# EasyEDA Pro project sfy3-v3.1.4.epro, board PCB_sfy3_1_1
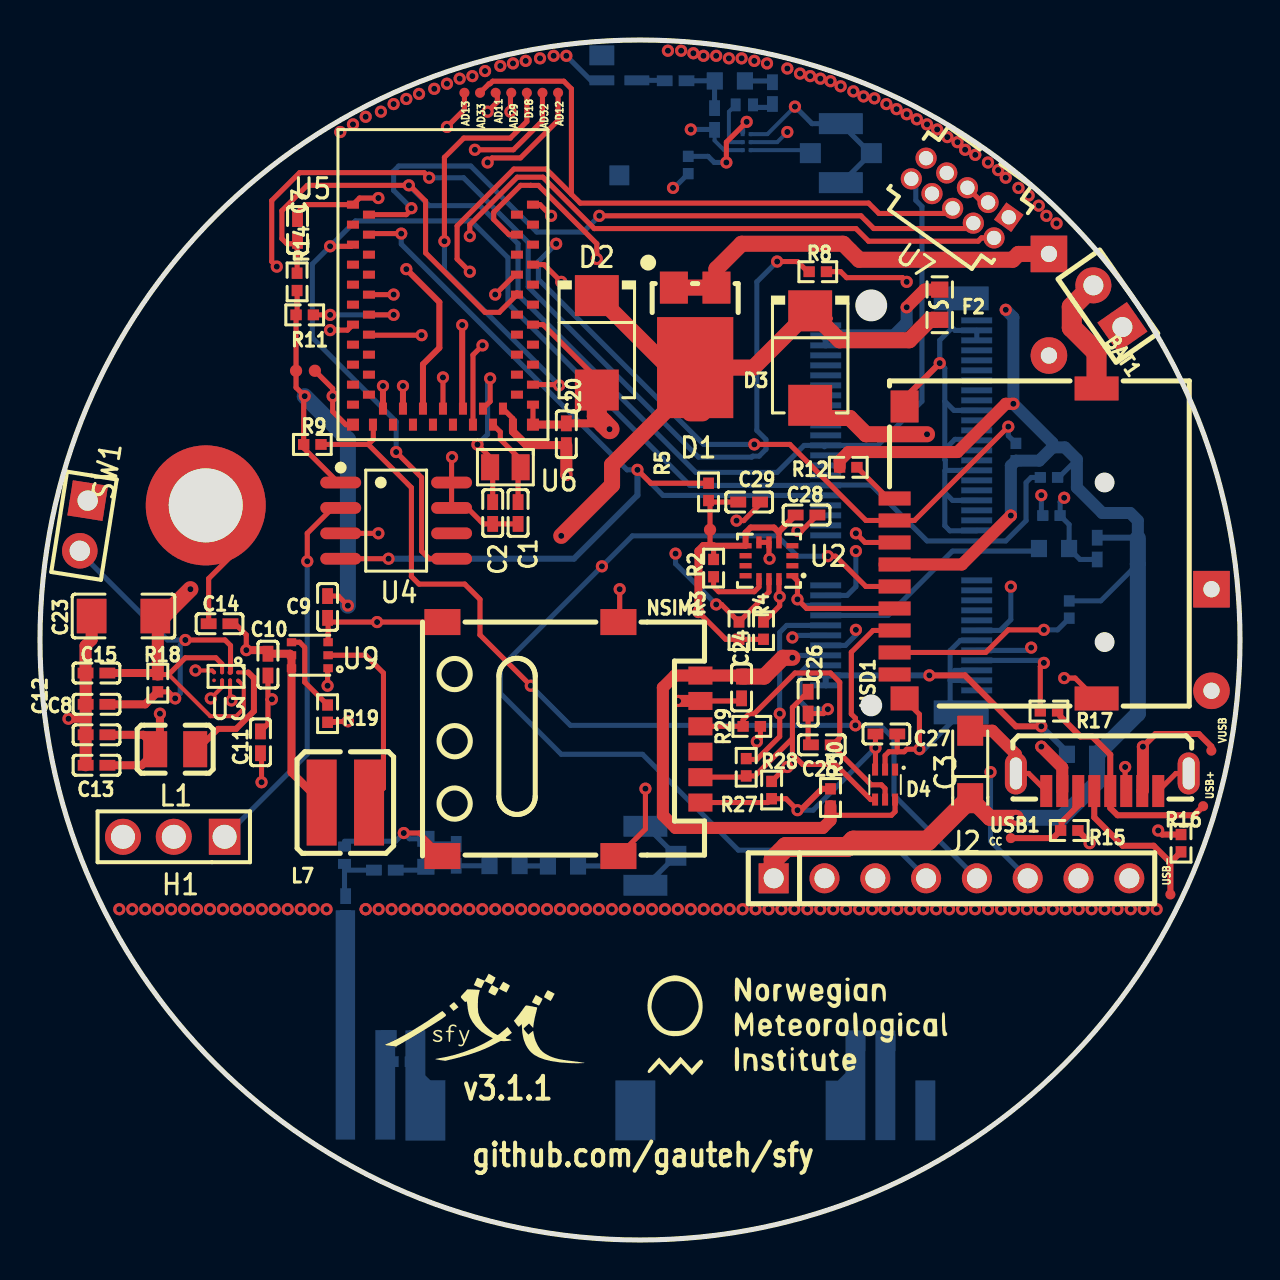
[diagram p32: board, top side]
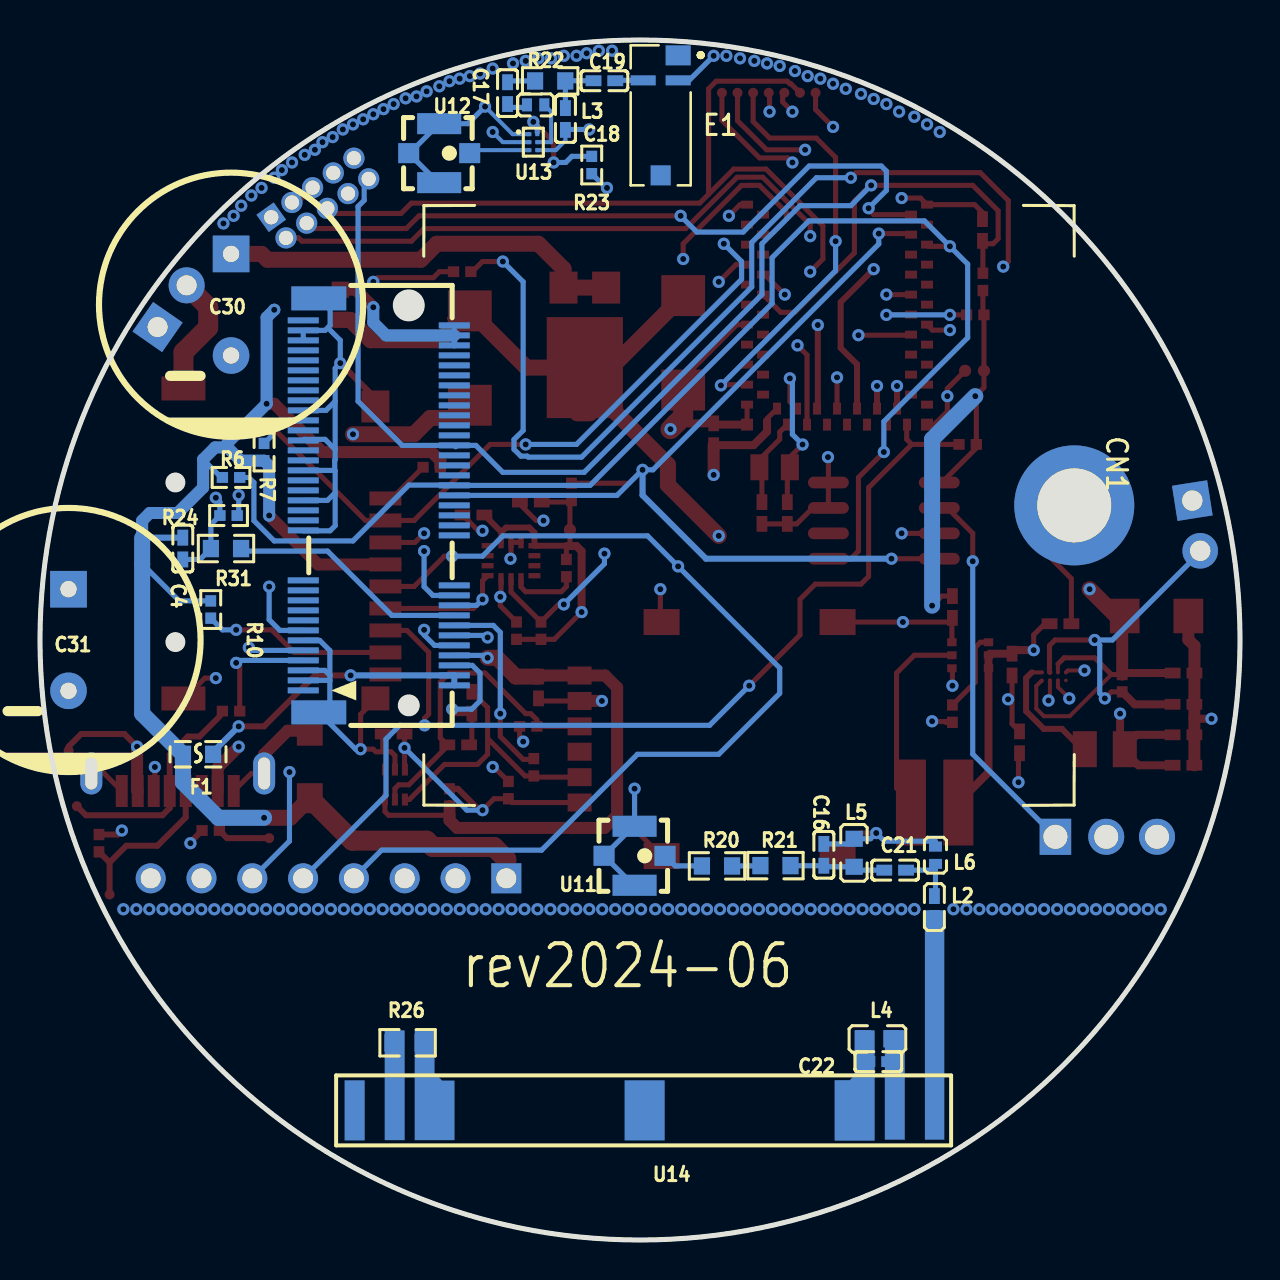
[diagram p33: board, bottom side, seen from below]

Outline 60 x 60 mm; copper layers: Top Layer, GND, POWER, Bottom Layer. Coordinates in mm from the lower left corner of the outline.
Outline path: circle c30,30 r30
Stack: Top Layer 0.035mm 外层铜厚1oz / Dielectric1 0.2104mm 7628 RC49% 8.6mil / GND 0.0152mm 内层铜厚 / Dielectric2 1.065mm 1.1mm H/HOZ 含铜 / POWER 0.0152mm 内层铜厚 / Dielectric3 0.2104mm 7628 RC49% 8.6mil / Bottom Layer 0.035mm 外层铜厚1oz

## Design rules (mm)
template: User Custom Config
spacing Default (default): track to track 0.152, other pairs 0 to 0.152
track width Default (default): min 0.2, default 0.254, max 25.4
differential pair differentialPair (default): width min 0.127, default 0.254, max 2.54; gap min 0.152, default 0.152
via Default (default): diameter min 0.61, default 0.61, max 100.025; hole min 0.305, default 0.305, max 59.995

## Placement (name value [footprint] x y rotation side)
AD11  -  [Test-Point-0.5mm]  22.78 57.36 0 top
AD12  -  [Test-Point-0.5mm]  25.9 57.36 0 top
AD13  -  [Test-Point-0.5mm]  21.22 57.36 0 top
AD29  -  [Test-Point-0.5mm]  23.56 57.36 0 top
AD32  -  [Test-Point-0.5mm]  25.12 57.36 0 top
AD33  -  [Test-Point-0.5mm]  22 57.36 0 top
BAT1  22284020  [HDR-TH_2P-P2.54-V-M-1]  53.39 46.69 124.8 top
C1  15pF  [C0402]  23.9 36.35 270 top
C2  15pF  [C0402]  22.63 36.35 270 top
C3  10uF  [CAP-SMD_L3.2-W1.6-RD]  46.51 23.78 90 top
C4  100nF  [C0402]  52.86 34.57 90 bottom
C7  1nF  [C0402]  12.88 50.5 90 top
C8  100nF  [C0402]  2.83 26.78 180 top
C9  100nF  [C0402]  14.38 31.65 270 top
C10  100nF  [C0402]  11.4 28.77 270 top
C11  10uF  [C0402]  11.02 24.88 90 top
C12  10uF  [C0402]  2.83 25.26 180 top
C13  10uF  [C0402]  2.83 23.74 180 top
C14  10uF  [C0402]  8.98 30.81 180 top
C15  4.7uF  [C0402]  2.82 28.35 0 top
C16  1pF  [C0402]  20.81 19.26 270 bottom
C17  1nF  [C0402]  36.62 57.34 90 bottom
C18  4.6pF  [C0402]  33.73 56.05 90 bottom
C19  1.1pF  [C0402]  31.78 57.96 180 bottom
C20  1uF  [C0402]  26.32 40.29 270 top
C21  2.2pF  [C0402]  17.24 18.49 180 bottom
C22  0.5pF  [C0402]  18.09 8.92 0 bottom
C23  47uF  [C1206]  4.17 31.2 0 top
C24  100nF  [C0402]  35.08 27.63 270 top
C25  33pF  [C0402]  39.09 24.76 0 top
C26  33pF  [C0402]  38.41 26.87 90 top
C27  33pF  [C0402]  42.32 25.3 180 top
C28  100nF  [C0402]  38.33 36.25 0 top
C29  100nF  [C0402]  35.46 36.9 0 top
C30  10F  [CP_12.5X20MM]  50.45 46.76 0 bottom
C31  10F  [CP_12.5X20MM]  58.58 30 0 bottom
CC  -  [Test-Point-0.5mm]  48.54 20.09 0 top
CN1  NOTECARD CONNECTOR  [NOTECARD-ext]  9.81 36.73 270 bottom
D1  FSV1045V  [TO-277A_L6.1-W4.6-P2.13-LS6.5-TR]  32.76 45.62 90 top
D2  SM6T6V8A  [SMB_L4.6-W3.6-LS5.3-RD]  27.84 44.86 270 top
D3  STPS3H100U  [SMB_L4.6-W3.6-LS5.3-RD]  38.51 44.1 270 top
D4  CESDLC5V0M5  [SOT-563_L1.6-W1.2-P0.50-LS1.6-BR]  42.25 22.77 90 top
D18  -  [Test-Point-0.5mm]  24.34 57.36 0 top
E1  -  [NN03-320]  28.97 56.23 90 bottom
F1  046701.5NRHF  [F0603]  52.1 24.28 0 bottom
F2  F0603FA3500V032T  [F0603]  44.99 46.76 270 top
H1  Header-Male-2.54_1x3  [HDR-TH_3P-P2.54-V-M-1]  6.69 20.16 180 top
J2  Header2.54mm 1*8P  [HDR-TH_8P-P2.54-V-M]  45.58 18.09 0 top
L1  2.2uH  [L0806]  6.76 24.54 0 top
L2  2.3nH  [L0402]  15.28 16.65 270 bottom
L3  7.5nH  [IND-SMD_L1.0-W0.6]  35.22 56.76 0 bottom
L4  12nH  [L0603]  18.14 10.06 0 bottom
L5  10nH  [L0603]  19.29 19.36 90 bottom
L6  8.4nH  [IND-SMD_L1.0-W0.6]  15.23 19.24 90 bottom
L7  2.2uH  [IND-SMD_L4.0-W4.0_XAL4040-103]  15.27 21.87 180 top
NOREF  -  [Pad_e50]  33.5 35.51 0 top
NOREF#2  -  [Pad_e1168]  13.74 43.46 0 top
NOREF#3  -  [Pad_e1148]  12.8 43.46 0 top
NSIM1  SMN-305  [SIM-SMD_SMN-305]  26.57 25.05 270 top
R2  10kΩ  [R0402]  33.68 33.59 90 top
R3  10kΩ  [R0402]  34.95 30.47 270 top
R4  10kΩ  [R0402]  36.18 30.47 270 top
R5  10kΩ  [R0402]  33.43 37.41 270 top
R6  10kΩ  [R0402]  50.45 38.13 0 bottom
R7  10kΩ  [R0402]  48.8 39.4 270 bottom
R8  10kΩ  [R0402]  38.89 48.42 0 top
R9  10kΩ  [R0402]  13.62 39.78 180 top
R10  10kΩ  [R0402]  51.46 31.52 90 bottom
R11  10kΩ  [R0402]  13.24 46.26 180 top
R12  10kΩ  [R0402]  40.41 38.64 180 top
R14  100kΩ  [R0402]  12.86 47.91 270 top
R15  5.1kΩ  [R0402]  51.46 20.48 0 top
R16  22Ω  [R0402]  57.05 19.84 90 top
R17  22Ω  [R0402]  50.45 26.44 180 top
R18  10MΩ  [R0402]  5.89 27.84 90 top
R19  82kΩ  [R0402]  14.38 26.32 90 top
R20  0Ω  [R0603]  26.15 18.7 180 bottom
R21  0Ω  [R0603]  23.23 18.72 180 bottom
R22  0Ω  [R0603]  34.49 57.95 180 bottom
R23  200kΩ  [R0402]  32.41 53.75 270 bottom
R24  100kΩ  [R0402]  50.57 36.22 180 bottom
R26  0Ω  [R0603]  41.62 9.86 0 bottom
R27  22Ω  [R0402]  36.58 22.5 270 top
R28  22Ω  [R0402]  35.31 23.64 270 top
R29  22Ω  [R0402]  35.59 25.68 180 top
R30  15kΩ  [R0402]  39.53 22.13 270 top
R31  0Ω  [R0603]  50.7 34.57 0 bottom
SW1  M.sw.  [2P]  2.19 35.72 261.1 top
U2  ISM330DHCXTR  [LGA-14_L3.0-W2.5-P0.50-BR]  36.45 33.96 0 top
U3  TPS62748YFPT  [DSBGA-8_L1.6-W0.9-R2-C4-P0.40-BL]  9.3 28.18 180 top
U4  DS2482S-100+T&R  [SOIC-8_L4.9-W3.9-P1.27-LS6.0-BL]  17.81 35.97 270 top
U5  SPARKFUN ARTEMIS BLE MODULE  [ARTEMIS_BLE]  15.65 40.77 90 top
U6  32.768kHz  [CRYSTAL-SMD_L2.0-W1.2]  23.27 38.64 180 top
U7  FTSH-105-01-F-D-K  [CONN-TH_10P-P1.27_FTSH-105-01-F-D-K]  46 52.1 144.5 top
U9  MAX17225ELT+T  [UDFN-6_L2.0-W2.0-P0.65-BL]  13.49 29.24 90 top
U11  CONMHF1-SMD-G-T  [RF-SMD_CONMHF1-SMD-G-T]  30.27 19.21 270 bottom
U12  CONMHF1-SMD-G-T  [RF-SMD_CONMHF1-SMD-G-T]  40.04 54.34 270 bottom
U13  BGA725L6E6327FTSA1  [TSLP-6_L1.1-W0.7-P0.40-BR]  35.33 54.89 0 bottom
U14  -  [NN03-310-NoSilk]  15.27 6.5 0 bottom
USB1  YTC-TC8S-125  [USB-C-SMD_YIYUAN_YTC-TC8S-125]  53.11 22.89 0 top
USB+  -  [Test-Point-0.5mm]  58.16 21.69 0 top
USB-  -  [Test-Point-0.5mm]  56.52 17.28 0 top
USD1  TF-CARD H1.8  [TF-SMD_TF-CARD-H1.8]  47.78 34.83 90 top
VUSB  -  [Test-Point-0.5mm]  58.57 24.47 0 top

## Footprints (pads in the part's own frame, mm; a bottom-side part is the same pattern mirrored in y, then rotated)
2P
  rect 1.778x1.778 hole 1.016: 1(-1.27,0)
  round 1.778 hole 1.016: 2(1.27,0)
ARTEMIS_BLE
  rect 0.4x0.6 smd: 1(11,0) 2(10.5,-0.8) 3(10,0) 4(9.5,-0.8) 5(9,0) 6(8.5,-0.8) 7(8,0) 8(7.5,-0.8) 9(7,0) 10(6.5,-0.8) 11(6,0) 12(5.5,-0.8) 13(5,0) 14(4.5,-0.8) 15(4,0) 16(3.5,-0.8) 17(3,0) 18(2.5,-0.8) 19(2,0) 20(1.5,-0.8) 21(1,0) 39(1,-8.999) 40(1.5,-8.2) 41(2,-8.999) 42(2.5,-8.2) 43(3,-8.999) 44(3.5,-8.2) 45(4,-8.999) 46(4.5,-8.2) 47(5,-8.999) 48(5.5,-8.2) 49(6,-8.999) 50(6.5,-8.2) 51(7,-8.999) 52(7.5,-8.2) 53(8,-8.999) 54(8.5,-8.2) 55(9,-8.999) 56(9.5,-8.2) 57(10,-8.999) 58(10.5,-8.2) 59(11,-8.999)
  rect 0.6x0.6 smd: 22(0,0) 38(0,-8.999)
  rect 0.6x0.4 smd: 23(0,-1) 24(0.8,-1.5) 25(0,-2) 26(0.8,-2.5) 27(0,-2.999) 28(0.8,-3.5) 29(0,-3.999) 30(0.8,-4.5) 31(0,-5) 32(0.8,-5.5) 33(0,-6) 34(0.8,-6.5) 35(0,-7) 36(0.8,-7.5) 37(0,-8)
C0402
  rect 0.79x0.54 smd: 1(-0.545,0) 2(0.545,0)
C1206
  rect 1.485x1.728 smd: 1(-1.593,0) 2(1.593,0)
CAP-SMD_L3.2-W1.6-RD
  rect 1.5x1.296 smd: 1(-1.687,0) 2(1.687,0)
CONN-TH_10P-P1.27_FTSH-105-01-F-D-K
  rect 1.06x1.06 hole 0.715x0.71: 1(-2.54,-0.635)
  round 1.06 hole 0.715x0.71: 2(-2.54,0.635) 3(-1.27,-0.635) 4(-1.27,0.635) 5(0,-0.635) 6(0,0.635) 7(1.27,-0.635) 8(1.27,0.635) 9(2.54,-0.635) 10(2.54,0.635)
CP_12.5X20MM
  rect 1.829x1.829 hole 0.813: 1(0,-2.54)
  round 1.829 hole 0.813: 2(0,2.54)
CRYSTAL-SMD_L2.0-W1.2
  rect 0.9x1.3 smd: 1(-0.762,0) 2(0.762,0)
DSBGA-8_L1.6-W0.9-R2-C4-P0.40-BL
  round 0.184 smd: A1(-0.6,-0.2) A2(-0.6,0.2) B1(-0.2,-0.2) B2(-0.2,0.2) C1(0.2,-0.2) C2(0.2,0.2) D1(0.6,-0.2) D2(0.6,0.2)
F0603
  rect 0.806x0.864 smd: 1(-0.753,0) 2(0.753,0)
HDR-TH_2P-P2.54-V-M-1
  rect 1.8x1.8 hole 1: 1(-1.27,0)
  round 1.8 hole 1: 2(1.27,0)
HDR-TH_3P-P2.54-V-M-1
  rect 1.575x1.8 hole 1.2: 1(-2.54,0)
  round 1.8 hole 1.2: 2(0,0) 3(2.54,0)
HDR-TH_8P-P2.54-V-M
  rect 1.5x1.5 hole 1: 1(-8.89,0)
  round 1.5 hole 1: 2(-6.35,0) 3(-3.81,0) 4(-1.27,0) 5(1.27,0) 6(3.81,0) 7(6.35,0) 8(8.89,0)
IND-SMD_L1.0-W0.6
  rect 0.5x0.648 smd: 1(-0.434,0) 2(0.434,0)
IND-SMD_L4.0-W4.0_XAL4040-103
  rect 1.5x4.3 smd: 1(-1.185,0) 2(1.185,0)
L0402
  rect 0.79x0.54 smd: 1(-0.545,0) 2(0.545,0)
L0603
  rect 0.8x0.864 smd: 1(-0.7,0) 2(0.7,0)
L0806
  rect 1.2x1.8 smd: 1(-1,0) 2(1,0)
LGA-14_L3.0-W2.5-P0.50-BR
  rect 0.6x0.27 smd: 1(1.17,-0.75) 2(1.17,-0.25) 3(1.17,0.25) 4(1.17,0.75) 8(-1.17,0.75) 9(-1.17,0.25) 10(-1.17,-0.25) 11(-1.17,-0.75)
  rect 0.27x0.6 smd: 5(0.5,0.92) 6(0,0.92) 7(-0.5,0.92) 12(-0.5,-0.92) 13(0,-0.92) 14(0.5,-0.92)
NN03-310-NoSilk
  custom 0.97x11.48 smd: 1(0.003,-4.242)
  custom 0.992x5.499 smd: 2(1.994,-1.238)
  custom 2.001x5.513 smd: 3(4,-1.22)
  rect 2x3 smd: 4(14.5,0.025)
  custom 1.986x5.486 smd: 5(25.003,-1.232)
  custom 0.992x5.486 smd: 6(27,-1.232)
  rect 1x3 smd: 7(29,0.025)
NN03-320
  rect 1x1 smd: 1(-3,0)
  custom 0.5x1.25 smd: 2(1.75,-0.875) 4(1.75,0.875)
  custom 1x1.25 smd: 3(3,-0.875)
NOTECARD-ext
  round 6 hole 3.7: 0(0,1.524)
  rect 0.3x1.55 smd: 1(9.25,-37.025) 2(9,-29.475) 3(8.751,-37.025) 4(8.5,-29.475) 5(8.25,-37.025) 6(8,-29.475) 7(7.75,-37.025) 8(7.5,-29.475) 9(7.25,-37.025) 10(7,-29.475) 11(6.75,-37.025) 12(6.5,-29.475) 13(6.25,-37.025) 14(6,-29.475) 15(5.75,-37.025) 16(5.5,-29.475) 17(5.25,-37.025) 18(5,-29.475) 19(4.75,-37.025) 20(4.5,-29.475) 21(4.25,-37.025) 22(4,-29.475) 23(3.751,-37.025) 32(1.5,-29.475) 33(1.25,-37.025) 34(1,-29.475) 35(0.75,-37.025) 36(0.5,-29.475) 37(0.25,-37.025) 38(0.001,-29.475) 39(-0.249,-37.025) 40(-0.5,-29.475) 41(-0.75,-37.025) 42(-1,-29.475) 43(-1.25,-37.025) 44(-1.5,-29.475) 45(-1.75,-37.025) 46(-2,-29.475) 47(-2.249,-37.025) 48(-2.5,-29.475) 49(-2.75,-37.025) 50(-2.999,-29.475) 51(-3.249,-37.025) 52(-3.5,-29.475) 53(-3.75,-37.025) 54(-3.999,-29.475) 55(-4.25,-37.025) 56(-4.5,-29.475) 57(-4.75,-37.025) 58(-5,-29.475) 59(-5.25,-37.025) 60(-5.5,-29.475) 61(-5.75,-37.025) 62(-6,-29.475) 63(-6.25,-37.025) 64(-6.5,-29.475) 65(-6.75,-37.025) 66(-7,-29.475) 67(-7.25,-37.025) 68(-7.5,-29.475) 69(-7.75,-37.025) 70(-8,-29.475) 71(-8.249,-37.025) 72(-8.5,-29.475) 73(-8.75,-37.025) 74(-8.999,-29.475) 75(-9.249,-37.025)
  rect 1.2x2.75 smd: 76(-10.35,-36.25) 77(10.35,-36.25)
Pad_e50
  round 0.61 smd: TP1(0,0)
Pad_e1148
  round 0.61 smd: TP1(0,0)
Pad_e1168
  round 0.61 smd: TP3(0,0)
R0402
  rect 0.566x0.54 smd: 1(-0.433,0) 2(0.433,0)
R0603
  rect 0.806x0.864 smd: 1(-0.753,0) 2(0.753,0)
RF-SMD_CONMHF1-SMD-G-T
  rect 1x1.05 smd: 1(0,1.525) 4(0,-1.525)
  rect 1.05x2.2 smd: 2(-1.475,0) 3(1.475,0)
SIM-SMD_SMN-305
  rect 1.3x1.8 smd: 1(5.85,-6.45) 2(-5.85,-6.45) 3(5.85,2.35) 4(-5.85,2.35)
  rect 0.9x1.2 smd: C1(-3.175,6.45) C2(-0.635,6.45) C3(1.905,6.45) C5(-1.905,6.45) C6(0.635,6.45) C7(3.175,6.45)
SMB_L4.6-W3.6-LS5.3-RD
  rect 2.047x2.192 smd: 1(-2.361,0) 2(2.361,0)
SOIC-8_L4.9-W3.9-P1.27-LS6.0-BL
  oval 0.588x2.045 smd: 1(-1.905,-2.772) 2(-0.635,-2.772) 3(0.635,-2.772) 4(1.905,-2.772) 5(1.905,2.772) 6(0.635,2.772) 7(-0.635,2.772) 8(-1.905,2.772)
SOT-563_L1.6-W1.2-P0.50-LS1.6-BR
  rect 0.6x0.3 smd: 1(0.75,-0.5) 2(0.75,0) 3(0.75,0.5) 4(-0.75,0.5) 5(-0.75,0) 6(-0.75,-0.5)
Test-Point-0.5mm
  round 0.5 smd: 1(0,0)
TF-SMD_TF-CARD-H1.8
  rect 0.7x1.6 smd: 1(2.25,5.05) 2(1.15,5.05) 3(0.05,5.05) 4(-1.05,5.05) 5(-2.15,5.05) 6(-3.25,5.05) 7(-4.35,5.05) 8(-5.45,5.05) 9(-6.55,5.05)
  rect 1.2x1.4 smd: 10(-7.747,4.55)
  rect 1.2x2.2 smd: 11(-7.75,-5.05) 12(7.75,-5.05)
  rect 1.6x1.4 smd: 13(6.85,4.55)
TO-277A_L6.1-W4.6-P2.13-LS6.5-TR
  rect 1.6x1.4 smd: 1(2,1.065) 2(2,-1.065)
  rect 5.05x3.81 smd: 3(-2,0)
TSLP-6_L1.1-W0.7-P0.40-BR
  rect 0.2x0.2 smd: 1(0.2,-0.4) 2(0.2,0) 3(0.2,0.4) 4(-0.2,0.4) 5(-0.2,0) 6(-0.2,-0.4)
UDFN-6_L2.0-W2.0-P0.65-BL
  rect 0.4x0.47 smd: 1(-0.65,-0.915) 2(0,-0.915) 3(0.65,-0.915) 4(0.65,0.915) 5(0,0.915) 6(-0.65,0.915)
USB-C-SMD_YIYUAN_YTC-TC8S-125
  oval 1.1x2.1 hole 0.6x1.6: 10(4.32,0.44) 11(-4.32,0.44)
  rect 0.6x1.6 smd: A5(-1.2,-0.44) A8(1.2,-0.44) A9(2,-0.44) A12(2.8,-0.44) B6(0.4,-0.44) B7(-0.4,-0.44) B9(-2,-0.44) B12(-2.8,-0.44)

## Nets
As in the schematic, except:
+3V3: C3.1 C4.2 C9.1 C11.1 C20.2 C28.1 C29.1 F1.2 H1.2 J2.1 NOREF.TP1 NOREF#3.TP1 R2.2 R3.2 R4.2 R5.2 R6.2 R7.2 R8.2 R9.2 R10.2 R11.2 R12.2 R14.2 U2.5 U2.8 U4.1 U5.36 U5.37 U7.1 U9.1 U13.2 USD1.4
GND: BAT1.2 C1.2 C2.2 C3.2 C4.1 C7.2 C8.2 C9.2 C10.2 C11.2 C12.2 C13.2 C14.2 C15.1 C16.1 C18.1 C20.1 C23.1 C24.2 C25.1 C26.1 C27.1 C28.2 C29.2 C31.2 CN1.0 CN1.3 CN1.5 CN1.6 CN1.11 CN1.18 CN1.33 CN1.39 CN1.45 CN1.51 CN1.57 CN1.71 CN1.73 CN1.76 CN1.77 D2.2 D4.2 E1.2 H1.3 J2.2 L5.2 L6.2 NOREF#2.TP3 NSIM1.1 NSIM1.2 NSIM1.3 NSIM1.4 NSIM1.C5 R15.2 R19.1 R24.1 R31.2 SW1.1 U2.1 U2.6 U2.7 U3.B2 U3.D1 U4.3 U4.7 U4.8 U5.1 U5.22 U5.38 U5.39 U5.47 U5.59 U7.3 U7.5 U7.9 U9.3 U11.2 U11.3 U11.4 U12.2 U12.3 U12.4 U13.1 U13.4 USB1.10 USB1.11 USB1.A8 USB1.A12 USB1.B12 USD1.6 USD1.10 USD1.11 USD1.12 USD1.13

Pads without a net: CN1 1 15 17 19 21 22 23 32 34 35 36 37 38 41 43 44 46 47 48 49 52 53 54 55 56 58 59 60 61 62 63 64 65 66 67 68 69 75; D4 1; E1 1 3; J2 3 8; NSIM1 C6; U2 2 3 4 9 10 11; U3 D2; U4 6; U5 3 6 7 8 9 11 15 16 17 18 19 20 21 25 27 29 31 40 42 43 44 45 46 48 49 51 54 55 57 58; U7 7 8; U14 4 7; USD1 9

## Via types
v1: diameter 0.61, hole 0.305, Top Layer to Bottom Layer, 255 vias

## Routing (per net, layer and track width the routed paths; a pad name or vN(x,y) marks a point on that pad's centre or on a via; arc(x,y) is an arc through that point)
1V8: length 27.2
  Top Layer w0.2: v1(8.54,27.08) 9.1,27.65 9.1,27.98
  Top Layer w0.254: v1(10.32,29.49) 10.32,30.25 9.76,30.81 C14.1
  Top Layer w0.4: 3.37,25.26 5.17,25.26 5.89,24.54 ; v1(6,26.32) 6,24.65 5.89,24.54 ; 5.89,24.54 5.08,23.74 3.37,23.74 ; L7.2 12.58,23.38 U9.6 U9.5 12.5,29.31 C10.1 11.22,29.49 v1(10.32,29.49)
  POWER w0.4: v1(10.32,29.49) 9.55,29.49 8.54,28.48 v1(8.54,27.08) 7.78,26.32 v1(6,26.32)
+3V3: length 215.8
  Top Layer w0.254: v1(15.4,31.72) 14.92,32.2 C9.1 ; v1(11.08,22.89) 11.08,24.29 C11.1 ; 12.86,46.31 R14.2 ; 12.86,46.31 12.86,46.26 ; 12.86,46.31 R11.2 NOREF#3.TP1 12.8,42.62 v1(13.24,42.19) 13.18,42.14 13.18,39.6 14.91,37.87 U4.1 ; U5.36 23.65,41.07 U5.37 ; R5.2 33.5,36.9 ; 33.5,36.9 C29.1 ; 33.5,36.9 NOREF.TP1 33.5,34.84 33.68,34.66 R2.2 ; R8.2 40.03,48.42 40.33,48.12 43.12,48.12 v1(43.34,47.91) ; U9.1 14.38,28.56 v1(14.38,27.71) ; R4.2 R3.2 34.28,30.03 v1(32.92,31.4) ; 36.95,35.37 U2.5
  Top Layer w0.3: C28.1 36.95,35.42 36.95,35.37 36.7,35.62 35.53,35.62 35.28,35.37 U2.8 33.73,34.71 33.68,34.66
  Top Layer w0.4: 33.64,34.7 33.18,34.7 32.92,34.45 v1(32.92,31.4) ; C20.2 24.32,39.74 23.65,40.42 U5.37
  Top Layer w0.6: v1(26.32,38.26) C20.2 ; v1(48.67,41.81) 48.29,41.81 45.88,39.4 40.42,39.4 39.98,38.96 R12.2 ; 42.23,33.78 46.09,33.78 v1(48.54,36.22)
  Top Layer w0.8: v1(48.8,21.11) 47.49,21.11 C3.1
  Top Layer w1: C3.1 44.39,19.97 40.67,19.97 40.35,19.65 37.3,19.65 36.69,19.03 J2.1
  POWER w0.254: v1(32.92,31.4) 32.79,31.4 ; 48.44,51.27 49.05,50.65 49.05,49.65 48.29,48.89 v1(48.29,46.51)
  POWER w0.6: v1(37.37,55.4) 37.37,53.88 v1(43.34,47.91) 44.73,46.51 v1(48.29,46.51)
  POWER w0.8: v1(26.32,38.26) 26.32,37.37 31.78,31.91 32.41,31.91 v1(32.92,31.4) ; H1.2 6.69,21.8 7.39,22.51 10.7,22.51 v1(11.08,22.89)
  POWER w1: 31.78,31.91 30.89,31.02 25.17,31.02 24.28,31.91 15.58,31.91 v1(15.4,31.72) 15.4,28.22 14.89,27.71 v1(14.38,27.71) 13.74,27.71 11.08,25.05 v1(11.08,22.89) ; J2.1 36.66,18.06 34.45,18.06 32.92,19.59 v1(32.92,31.4)
  Bottom Layer w0.2: v1(37.37,55.4) 36.86,54.89 U13.2
  Bottom Layer w0.254: R10.2 53.04,31.96 54.89,33.81 ; R6.2 50.94,38.13 51.84,39.03
  Bottom Layer w0.3: C4.2 54.87,35.12 54.89,35.09
  Bottom Layer w0.6: v1(48.29,46.51) 48.67,46.13 v1(48.67,41.81) 50.63,39.85 50.63,39.63 ; 50.63,39.63 49.96,38.97 R7.2 48.54,38.71 v1(48.54,36.22) ; 50.63,39.63 51.24,39.63 51.84,39.03 51.84,37.62 53.11,36.35 54.51,36.35 54.89,35.97 54.89,35.09
  Bottom Layer w0.8: 54.89,35.09 54.89,26.32 52.86,24.28 F1.2 52.85,22.88 51.08,21.11 v1(48.8,21.11) ; v1(13.24,42.19) 15.4,40.03 v1(15.4,31.72)
GND: length 180.7
  Top Layer w0.2: 9.5,27.98 9.5,27.05 v1(9.57,26.98) ; v1(7.78,28.48) 8.61,28.48 8.7,28.38
  Top Layer w0.254: 14.41,31.08 14.59,30.9 v1(16.86,30.9) NSIM1.2 ; 14.41,31.08 C9.2 ; 14.41,31.08 U9.3 ; 42.86,24.41 42.45,24.41 42.25,24.22 D4.2 ; 42.86,24.41 43.21,24.41 43.34,24.54 v1(43.97,24.54) 43.97,26.28 43.23,27.03 ; 42.86,24.41 C27.1 ; v1(28.98,32.54) 28.98,30.96 NSIM1.4 ; NSIM1.3 30.27,20.55 v1(30.27,22.57) ; R19.1 14.71,25.88 14.75,25.92 ; USB1.A12 56.79,23.33 USB1.10 ; v1(20.6,39.14) 20.58,39.12 U4.8 U4.7 21.36,36.6 22.16,35.81 C2.2 C1.2 ; 9.81,36.73 9.81,34.45 8.43,33.07 C14.2 ; D2.2 27.84,43.08 25.15,45.77 U5.47 ; 11.4,27.02 C10.2 ; 11.4,27.02 11.58,27.02 v1(11.6,27.04) ; 11.4,27.02 11.4,25.8 C11.2 ; NOREF#2.TP3 14.63,42.57 v1(14.63,42.19) 14.63,41.42 15.29,40.77 U5.22 ; U5.39 U5.38 ; C25.1 38.41,24.9 C26.1 39.17,26.32 v1(39.39,26.54) ; v1(34.83,35.97) 35.19,35.97 36,36.79 36,36.9 ; U5.59 25,51.77 v1(25.56,51.21) ; USB1.B12 49.43,23.33 USB1.11 ; v1(51.21,28.09) 51.76,28.09 52.83,27.03 ; 14.75,25.92 15.38,25.92 v1(15.4,25.94) ; 14.75,25.92 14.33,25.92 ; C7.2 12.88,51.37 13.27,51.77 U5.1 15.98,52.1 v1(16.92,52.1) ; U7.5 47.11,51.88 U7.3 ; NSIM1.C5 34.95,26.95 C24.2 ; U2.1 37.87,32.96 v1(37.87,32.03) 38.33,31.58 42.23,31.58 ; v1(36.48,34.06) 36.45,34.09 U2.6 U2.7 ; v1(16.92,35.33) U4.3 ; v1(37.87,35.46) 38.08,35.46 38.87,36.25 ; USB1.A8 54.26,22.51 v1(54.26,23.65) ; v1(18.19,20.35) 18.97,20.35 NSIM1.1
  Top Layer w0.3: v1(52.48,19.84) 52.48,19.89 51.9,20.48 ; v1(44.99,43.84) 43.23,42.08 43.23,41.68
  Top Layer w0.4: 2.28,26.08 2.26,26.06 v1(1.43,26.06) ; U5.38 26.25,40.77 C20.1 28.19,40.83
  Top Layer w0.6: v1(31.91,26.95) NSIM1.C5 ; C23.1 2.58,30.01 2.28,29.71 C15.1 2.28,28.34 C8.2 C12.2 C13.2 ; USB1.11 48.79,24.29 47.62,25.46 C3.2
  Top Layer w1: 52.83,42.63 52.83,44.39 51.59,45.62 51.59,46.66 BAT1.2 ; D2.2 27.84,41.18 v1(28.48,40.54)
  Bottom Layer w0.2: U13.4 34.21,54.49 33.73,54.97 C18.1 ; v1(37.75,56.67) 36.37,55.29 U13.1
  Bottom Layer w0.254: CN1.39 45.63,36.98 45.24,37.37 ; CN1.71 CN1.73 45.75,45.48 45.49,45.73 45.49,46.51 CN1.76 ; C4.1 52,34.03 R31.2 51.45,35.78 R24.1 51.01,36.91 v1(51.21,37.11) ; v1(30.27,22.57) U11.2 30.32,20.69 U11.4 30.32,17.74 U11.3 ; v1(39.39,26.54) 38.41,26.54 38,26.95 38,28.35 38.38,28.73 CN1.6 ; v1(43.97,24.54) 44.22,24.54 46.06,26.38 45.51,26.94 45.51,27.98 ; CN1.33 46.82,35.46 45.49,35.46 45.24,35.72 45.24,37.37 ; 44.99,43.87 44.99,44.99 45.49,45.49 ; CN1.11 46.02,29.98 45.51,29.47 45.51,28.23 ; C18.1 33.71,55.53 v1(32.54,55.53) ; 45.27,38.48 45.27,38.99 45.24,39.02 45.24,39.53 ; 45.27,38.48 45.24,38.45 45.24,37.37 ; 45.27,38.48 CN1.45 ; 15.23,19.94 17.78,19.94 v1(18.19,20.35) 18.47,20.06 L5.2 19.55,19.8 C16.1 ; 45.24,41.94 45.24,43.59 v1(44.99,43.84) ; 45.24,41.94 45.7,41.48 CN1.57 ; 45.24,41.94 45.24,39.53 ; 45.51,28.23 45.75,28.48 CN1.5 ; 45.51,28.23 45.51,27.98 ; v1(37.75,56.67) 38.6,55.82 U12.2 41.52,54.34 U12.4 40.09,52.87 U12.3 ; 45.51,27.98 CN1.3 ; CN1.51 46.78,40.03 45.75,40.03 45.24,39.53 ; CN1.18 38.18,31.73 v1(37.87,32.03) ; 28.09,57.98 27.54,57.98 v1(26.32,59.21)
  Bottom Layer w0.3: v1(44.99,43.84) 44.99,43.87
  vias: v1(3.97,16.54) v1(4.61,16.54) v1(5.26,16.54) v1(5.91,16.54) v1(6.56,16.54) v1(7.2,16.54) v1(7.85,16.54) v1(8.5,16.54) v1(9.15,16.54) v1(9.79,16.54) v1(10.44,16.54) v1(11.09,16.54) v1(11.74,16.54) v1(12.39,16.54) v1(13.03,16.54) v1(13.68,16.54) v1(14.33,16.54) v1(15.01,55.4) v1(15.65,55.78) v1(16.28,56.16) v1(16.28,16.54) v1(16.28,16.54) v1(16.93,16.54) v1(17.05,56.42) v1(17.58,16.54) v1(17.68,56.8) v1(18.23,16.54) v1(18.32,57.05) v1(18.88,16.54) v1(18.95,57.31) v1(19.52,16.54) v1(19.71,57.56) v1(20.17,16.54) v1(20.35,57.81) v1(20.82,16.54) v1(20.98,58.07) v1(21.47,16.54) v1(21.62,58.19) v1(22.11,16.54) v1(22.25,58.45) v1(22.76,16.54) v1(23.02,58.7) v1(23.41,16.54) v1(23.65,58.83) v1(24.06,16.54) v1(24.28,58.96) v1(24.7,16.54) v1(25,59.08) v1(25.35,16.54) v1(25.68,59.21) v1(26,16.54) v1(26.65,16.54) v1(27.3,16.54) v1(27.94,16.54) v1(28.59,16.54) v1(29.24,16.54) v1(29.95,16.54) v1(30.59,16.54) v1(31.24,16.54) v1(31.4,59.46) v1(31.89,16.54) v1(32.06,59.46) v1(32.54,16.54) v1(32.67,59.34) v1(33.18,59.21) v1(33.19,16.54) v1(33.81,59.21) v1(33.83,16.54) v1(34.45,59.08) v1(34.48,16.54) v1(35.08,59.08) v1(35.13,16.54) v1(35.72,58.96) v1(35.78,16.54) v1(36.35,58.83) v1(36.42,16.54) v1(37.07,16.54) v1(37.37,58.58) v1(37.72,16.54) v1(38,58.32) v1(38.37,16.54) v1(38.51,58.19) v1(39.02,58.07) v1(39.01,16.54) v1(39.53,57.94) v1(39.66,16.54) v1(40.03,57.69) v1(40.31,16.54) v1(40.67,57.43) v1(40.96,16.54) v1(41.18,57.18) v1(41.61,16.54) v1(41.72,57.08) v1(42.22,16.54) v1(42.32,56.8) v1(42.83,56.54) v1(42.87,16.54) v1(43.34,56.29) v1(43.51,16.54) v1(43.84,56.03) v1(44.16,16.54) v1(44.35,55.78) v1(44.86,55.53) v1(44.81,16.54) v1(45.37,55.15) v1(45.46,16.54) v1(45.88,54.89) v1(46.1,16.54) v1(46.26,54.51) v1(46.76,54.26) v1(46.75,16.54) v1(47.4,53.88) v1(47.4,16.54) v1(47.91,53.5) v1(48.05,16.54) v1(48.29,53.11) v1(48.69,16.54) v1(48.92,52.61) v1(49.34,16.54) v1(49.43,52.23) v1(49.94,51.72) v1(49.99,16.54) v1(50.32,51.21) v1(50.64,16.54) v1(50.83,50.83) v1(51.28,16.54) v1(51.93,16.54) v1(52.58,16.54) v1(53.23,16.54) v1(53.88,16.54) v1(54.54,16.54) v1(55.18,16.54) v1(55.83,16.54)
VBAT: length 27.7
  Top Layer w0.8: C30.1 48.92,49.3 48.63,49.01 40.96,49.01 40.16,49.81 35.08,49.81 33.82,48.56 D1.2 D1.1
  POWER w1: C30.1 50.45,47.02 52.48,44.99 53.46,44.99 54.12,45.65
I_CS: length 3.4
  Top Layer w0.254: R2.1 33.68,32.67 33.94,32.41 35.72,32.41 35.95,32.65 U2.12
I_SCL: length 25.4
  Top Layer w0.254: U2.13 36.45,32.4 R3.1 34.07,31.78 v1(33.81,31.78) ; U5.53 25.2,48.77 v1(26.06,47.91)
  POWER w0.254: v1(26.06,47.91) 26.06,45.11 27.71,43.46 27.71,38.38 v1(31.78,34.32)
  Bottom Layer w0.254: v1(33.81,31.78) 31.78,33.81 v1(31.78,34.32)
I_SDA: length 27.5
  Top Layer w0.254: U2.14 36.95,32.2 v1(36.99,32.16) 36.99,31.71 R4.1 ; U5.52 23.76,48.27 v1(22.76,47.27)
  POWER w0.254: v1(22.76,47.27) 27.08,42.95 27.08,37.87 32.29,32.67 34.19,32.67 34.7,32.16 v1(36.99,32.16)
NC_SCL: length 49.8
  Top Layer w0.254: v1(18.06,50.32) 16.5,50.32 U5.4 ; v1(17.43,34.06) U4.4 ; R5.1 30.54,37.84 v1(29.87,38.51)
  Bottom Layer w0.254: v1(18.06,50.32) 18.06,49.8 29.35,38.51 v1(29.87,38.51) 31.15,37.23 CN1.40
  Bottom Layer w0.3: v1(17.43,34.06) 26.7,34.06 29.87,37.24 v1(29.87,38.51)
NC_SDA: length 67.2
  Top Layer w0.254: v1(14.51,49.69) 15.56,49.69 U5.5 ; v1(17.81,39.4) 19.08,38.13 19.08,34.45 19.46,34.06 U4.5
  Bottom Layer w0.254: R6.1 49.56,38.13 49.3,37.87 49.3,35.97 48.29,34.95 44.35,34.95 41.56,37.75 39.3,37.75 CN1.42 32.49,37.73 23.4,46.83 23.4,49.11 21.56,50.95 15.78,50.95 v1(14.51,49.69) 13.62,48.8 13.62,45.11 17.81,40.92 v1(17.81,39.4)
NRESET: length 66.7
  Top Layer w0.254: 12.69,49.81 12.35,49.81 12.09,50.07 12.09,51.46 13.36,52.73 18.49,52.73 19.28,51.94 19.28,49.36 22.25,46.38 22.96,46.38 U5.50 23.85,47.37 ; R14.1 12.86,49.81 13,49.95
  Bottom Layer w0.254: v1(18.44,52.73) 19.46,51.72 22,51.72 23.9,49.81 23.9,47.27 32.79,38.38 36.86,38.38 38.21,39.73 CN1.50 ; CN1.50 41.89,39.73 44.1,41.94 44.1,51.68 43.79,51.98 43.79,52.83 43.57,53.06 ; CN1.50 39.22,39.66
PT_CS: length 52.8
  Top Layer w0.254: U5.56 23.45,50.27 22.69,51.03 22.69,51.39 24.03,52.73 24.53,52.73 24.54,52.73 24.92,52.73 27.84,49.81 v1(27.84,49.05)
  POWER w0.254: J2.7 50.3,19.71 46.26,19.71 43.21,22.76 43.21,29.24 28.09,44.35 28.09,48.8 v1(27.84,49.05)
SD_CD: length 45.8
  Top Layer w0.254: v1(19.08,45.24) 16.48,45.24 U5.14 ; v1(48.42,40.67) 43.72,35.98 USD1.2 41.3,35.98 37.49,39.78 v1(35.72,39.78)
  POWER w0.254: v1(19.08,45.24) 19.08,46.95 21.68,49.56 25.56,49.56 v1(25.81,49.81)
  Bottom Layer w0.254: v1(48.42,40.67) 48.42,40.21 R7.1 ; v1(25.81,49.81) 24.92,48.92 24.92,48.03 33.18,39.78 v1(35.72,39.78)
SD_MISO: length 54.1
  Top Layer w0.254: 42.23,30.48 41.65,30.48 40.57,29.39 40.57,26.3 40.77,26.09 v1(40.77,25.73) ; U5.23 16.67,40.75 16.67,40.03 16.41,39.78 ; 16.41,39.78 14.18,39.78 14.05,39.91 ; 16.41,39.78 18.57,37.62 18.57,33.17 18.95,32.79 21.24,32.79 22,32.03 22,30.25 v1(24.54,27.71)
  Bottom Layer w0.254: v1(24.54,27.71) 26.52,25.73 v1(40.77,25.73) 42.01,25.73 42.7,25.05 42.7,22.23 J2.5
SD_MOSI: length 92.4
  Top Layer w0.254: v1(36.86,48.92) 37.87,48.92 38.38,48.42 R8.1 ; v1(19.46,53.11) 19.21,53.37 12.98,53.37 11.59,51.97 11.59,48.92 v1(11.84,48.67) ; v1(14.51,45.49) 15.37,45.49 U5.13 ; v1(40.8,35.33) 41.25,34.88 42.23,34.88
  POWER w0.254: v1(14.51,45.49) 12.35,45.49 11.84,46 v1(11.84,48.67) ; v1(36.86,48.92) 40.31,45.47 40.31,35.59 40.57,35.33 v1(40.8,35.33) 46.26,29.87 46.26,24.67 v1(47.53,23.4)
  Bottom Layer w0.254: v1(36.86,48.92) 35.84,47.91 35.84,40.48 36.3,40.02 36.3,39.54 35.96,39.19 35.64,39.19 35.59,39.14 32.92,39.14 24.41,47.65 24.41,49.88 21.18,53.11 v1(19.46,53.11) ; v1(47.53,23.4) 47.53,19.94 J2.6
SD_SCK: length 72.4
  Top Layer w0.254: v1(39.4,34.19) 39.78,34.19 41.29,32.68 42.23,32.68 ; v1(14.51,46.26) R11.1 ; v1(17.68,46.26) 16.46,46.26 U5.12
  POWER w0.254: v1(17.68,46.26) 17.68,44.1 20.86,40.92 22.25,40.92 23.14,40.03 23.14,39.07 28.09,34.12 v1(28.09,33.68)
  Bottom Layer w0.254: v1(39.4,34.19) 37.87,34.19 36.86,35.21 29.62,35.21 v1(28.09,33.68) 23.02,28.6 23.02,27.33 26.06,24.28 30.13,24.28 34.92,19.49 42.92,19.49 44.31,18.11 J2.4 ; v1(14.51,46.26) v1(17.68,46.26)
SIM_CLK: length 9.8
  Top Layer w0.254: R28.1 35.35,24.03 35.84,24.03 36.99,25.17 v1(36.99,26.32)
  Bottom Layer w0.254: CN1.14 37.34,30.73 36.99,30.38 v1(36.99,26.32)
SIM_DAT2: length 2.1
  Top Layer w0.254: 42.23,37.08 42.23,37.26 R12.1
SIM_IO: length 10
  Top Layer w0.254: R27.1 37.3,23.65 v1(37.37,23.65)
  POWER w0.254: v1(37.62,30.13) 38.2,29.54 38.2,28.43 37.62,27.84 37.62,23.9 v1(37.37,23.65)
  Bottom Layer w0.254: v1(37.37,23.65) 37.37,23.52 ; v1(37.62,30.13) 37.72,30.23 CN1.12
SIM_RST: length 17.5
  Top Layer w0.254: R29.1 36.02,25.1 v1(35.84,24.92)
  POWER w0.254: v1(35.84,24.92) 35.84,22.63 36.1,22.38 39.41,22.38 40.16,23.13 40.16,29.87 v1(40.8,30.51)
  Bottom Layer w0.254: v1(40.8,30.51) 40.8,30.25 40.27,29.73 CN1.10
SIM_VCC: length 28.7
  Top Layer w0.254: D4.6 42.75,21.42 42.57,21.24 39.53,21.24
  Top Layer w0.6: C24.1 35.03,28.22 NSIM1.C1 31.74,28.22 31.14,27.62 31.14,21.24 31.78,20.6 39.14,20.6 39.53,20.98 R30.2
  Top Layer w0.8: v1(37.62,29.11) 37.15,29.11 36.21,28.17 C24.1
  Bottom Layer w0.254: v1(37.62,29.11) 37.74,29.23 CN1.8
SWDCLK: length 35.7
  Top Layer w0.254: v1(27.97,51.21) 41.05,51.21 41.68,50.57 46.4,50.57 U7.4 ; v1(18.57,51.59) 18.57,51.52 18.32,51.27 U5.2
  Bottom Layer w0.254: v1(18.57,51.59) 17.68,52.48 17.68,53.44 17.94,53.7 21.54,53.7 24.84,50.4 27.16,50.4 v1(27.97,51.21)
SWDIO: length 35.4
  Top Layer w0.254: v1(17.68,47.27) 17.68,47.27 U5.10 ; v1(21.49,50.19) 21.49,50.77 23.86,53.14 25.14,53.14 27.71,50.57 40.8,50.57 41.43,49.94 46.91,49.94 47.07,50.11 47.7,50.11
  POWER w0.254: v1(17.68,47.27) 18.57,47.27 v1(21.49,50.19)
SWO: length 47.2
  Top Layer w0.254: 26.57,52.29 25.31,53.55 23.69,53.55 20.86,50.71 20.86,49.05 v1(21.49,48.42) ; 26.57,52.29 27.01,51.84 41.43,51.84 41.95,51.33 45.38,51.33 U7.6 ; 26.57,52.29 26.57,57.56 26.19,57.94 22.63,57.94 22.51,57.81 22.45,57.81 22.06,57.41 22.06,57.49 ; U5.30 v1(20.15,43.13)
  POWER w0.254: v1(21.49,48.42) 20.15,47.07 v1(20.15,43.13)
USBD+: length 5.9
  Top Layer w0.254: v1(50.19,28.86) 50.01,28.68 R17.2 50.01,26.42
  Bottom Layer w0.254: CN1.7 50.07,28.98 v1(50.19,28.86)
USBD-: length 17.9
  Top Layer w0.3: R16.2 56.11,20.27 v1(55.91,20.48)
  POWER w0.3: v1(55.91,20.48) 55.91,25.43 54.77,26.57 54.77,28.09 54.13,28.73 51.72,28.73 50.83,29.62 v1(49.56,29.62)
  Bottom Layer w0.254: v1(49.56,29.62) 49.42,29.48 CN1.9
VACT_GPS_OUT: length 26.6
  POWER w0.254: v1(31.65,52.61) 39.65,44.61 39.65,35.33 40.54,34.45 v1(40.8,34.45)
  Bottom Layer w0.254: v1(31.65,52.61) 31.7,52.61 R23.2 ; CN1.20 40.36,32.23 40.8,32.67 v1(40.8,34.45)
VMAIN: length 72.3
  Top Layer w0.2: 9.1,28.38 9.1,28.8 ; 9.91,27.95 9.93,27.95 10.19,27.7 10.19,26.57 9.81,26.19 8.51,26.19 6.43,28.27
  Top Layer w0.254: 9.1,28.8 8.79,29.11 7.27,29.11 6.43,28.27 R18.2 ; 32.73,41.11 32.15,41.68 ; 37.9,45.85 38.18,46.08 39.53,46.08 ; 32.15,41.68 31.96,41.87 32.15,42.06 32.15,41.68
  Top Layer w0.4: R18.2 5.82,28.35 C15.2
  Top Layer w0.6: R18.2 5.89,31.08 5.77,31.2
  Top Layer w0.8: 32.5,41.33 33.14,41.33 ; v1(7.52,32.54) 6.18,31.2 5.77,31.2 ; v1(26.06,35.21) 28.6,37.75 28.6,38.76 32.76,42.92 D1.3 ; D2.1 31.44,43.62 D1.3 ; D1.3 35.67,43.62 37.9,45.85 ; 44.74,46 44.48,46 43.46,44.99 39.98,44.99 38.89,46.08
  POWER w0.8: 26.05,35.2 24.06,33.21 14.16,33.21 13.49,32.54 v1(7.52,32.54)
VUSB: length 42.4
  Top Layer w0.3: v1(55.15,24.67) 55.78,25.3 57.94,25.3 58.57,24.67 VUSB.1
  Top Layer w0.6: v1(55.15,24.67) 55.15,22.48 USB1.A9 ; v1(50.07,24.67) 51.11,23.62 USB1.B9
  Top Layer w0.8: v1(44.35,40.29) 41.3,40.29 40.49,41.1 39.14,41.1 D3.2
  POWER w0.8: v1(44.35,40.29) 44.35,37.75 48.54,33.56 v1(48.54,32.67) 48.54,25.68 49.56,24.67 v1(50.07,24.67) v1(55.15,24.67)
  Bottom Layer w0.254: CN1.13 48.01,30.48 48.54,31.02 v1(48.54,32.67)
$1N5: length 8.1
  Top Layer w0.6: F2.1 44.22,47.52 v1(43.34,46.64)
  Bottom Layer w0.254: CN1.72 CN1.74
  Bottom Layer w0.3: CN1.72 CN1.70
  Bottom Layer w0.6: v1(43.34,46.64) 43.34,45.88 42.69,45.23 CN1.72
$1N27: length 12
  Bottom Layer w0.254: R31.1 49.82,34.45 45.62,34.45 42.41,31.23 CN1.16
$1N1900: length 3
  Bottom Layer w0.2: U13.3 38.37,54.49 38.52,54.34
$1N1978: length 1.4
  Bottom Layer w0.254: E1.4 31.22,57.98 C19.2
$1N2069: length 2.7
  Bottom Layer w0.2: L3.1 34.45,56.42 34.45,54.89 U13.5
$1N2072: length 1
  Bottom Layer w0.254: 35.65,56.63 36.45,56.63 C17.1
$1N2075: length 1.4
  Bottom Layer w0.254: R22.1 36.56,57.95 C17.2
$1N2105: length 2.8
  Bottom Layer w0.254: C18.2 33.73,57.95 R22.2 33.73,57.96 C19.1
$1N2207: length 29.8
  Top Layer w0.254: v1(35.33,55.91) 34.32,54.89 v1(34.32,53.88)
  POWER w0.254: v1(50.07,37.24) 49.28,37.24 37.44,49.08 37.44,49.17 37.1,49.51 37.01,49.51 34.32,52.2 v1(34.32,53.88)
  Bottom Layer w0.254: R23.1 33.41,54.18 33.71,53.88 v1(34.32,53.88) ; v1(50.07,37.24) 50.07,36.3 R24.2 ; 35.13,55.37 35.13,55.71 v1(35.33,55.91)
$1N3253: length 2.1
  Bottom Layer w0.254: 26.9,18.7 28.24,18.7 U11.1
$1N3261: length 1.4
  Bottom Layer w0.254: R20.2 24,18.7 R21.1
$1N3697: length 4.8
  Bottom Layer w0.254: 17.79,18.49 19.12,18.49 L5.1 20.76,18.66 C16.2 22.47,18.71 R21.2
$1N3711: length 2.9
  Bottom Layer w0.254: L2.1 15.23,17.25 15.23,18.54 15.27,18.49 C21.2
$1N3824: length 14.3
  Top Layer w0.3: v1(44.47,28.23) 46.25,28.23 48.8,25.68 v1(50.07,25.68)
  Bottom Layer w0.3: v1(44.47,28.23) CN1.4 CN1.2 ; F1.1 51.34,24.4 v1(50.07,25.68)
$2N34: length 19.1
  Top Layer w0.254: U4.2 14.63,36.6 13.36,35.33 v1(13.36,33.94)
  Bottom Layer w0.254: v1(13.36,33.94) 13.36,24.29 H1.1
$2N19158: length 9.4
  Top Layer w0.254: v1(50.19,30.51) 48.42,30.51 47.28,29.38 USD1.8
  Bottom Layer w0.254: v1(50.19,30.51) 50.88,30.51 51.46,31.09
$3N3: length 8.4
  Top Layer w0.254: U5.34 22.51,41.93 v1(22.51,43.08) ; C2.1 22.63,38.51 U6.2 22.51,39.14 v1(21.87,39.77)
  Bottom Layer w0.254: v1(22.51,43.08) 22.38,42.95 22.38,40.28 v1(21.87,39.77)
$3N4: length 4.5
  Top Layer w0.254: C1.1 23.9,38.51 U6.1 24.03,39.02 23.02,40.03 23.02,40.4 U5.35
$3N3757: length 21.7
  Top Layer w0.254: 22.87,57.36 22.87,56.9 v1(22.38,56.42)
  Top Layer w0.3: U5.32 21.11,41.61 v1(21.11,45.75)
  POWER w0.254: v1(22.38,56.42) 24.41,54.38 24.41,53.24 26.57,51.08 26.57,49.69 25.94,49.05 23.02,49.05 21.11,47.15 v1(21.11,45.75)
$3N3767: length 23.1
  Top Layer w0.254: AD12.1 25.9,55.99 24.02,54.1 22.61,54.1 v1(22.38,53.88)
  Top Layer w0.3: U5.26 v1(18.15,42.7)
  POWER w0.254: v1(22.38,53.88) 18.32,53.88 17.81,53.37 17.81,51.59 17.05,50.83 17.05,43.8 v1(18.15,42.7)
$3N3770: length 21.7
  Top Layer w0.254: v1(20.35,55.65) 21.22,56.53 AD13.1
  Top Layer w0.3: U5.28 19.15,43.79 19.97,44.61 19.97,46.89 v1(18.32,48.54)
  POWER w0.254: v1(20.35,55.65) 21.87,55.65 23.02,54.51 23.02,52.61 22.25,51.84 21.19,51.84 18.32,48.97 v1(18.32,48.54)
$3N3773: length 22.2
  Top Layer w0.254: v1(23.52,56.42) 23.52,57.26 23.63,57.36 ; v1(22.13,44.73) 21.65,44.25 U5.33
  POWER w0.254: v1(23.52,56.42) 24.92,55.02 24.92,53.5 27.08,51.34 27.08,49.3 26.32,48.54 23.14,48.54 22.13,47.53 v1(22.13,44.73)
$3N3776: length 23
  Top Layer w0.254: v1(21.75,54.51) 23.67,54.51 25.12,55.96 AD32.1
  Top Layer w0.3: U5.24 v1(17.15,42.7)
  POWER w0.254: v1(17.15,42.7) 16.16,43.69 16.16,52.29 18.38,54.51 v1(21.75,54.51)
$3N3779: length 21.4
  Top Layer w0.254: v1(20.22,49.94) 20.22,54.13 21.19,55.1 23.51,55.1 24.34,55.93 D18.1 ; U5.41 25.92,42.77 v1(25.96,42.73)
  Bottom Layer w0.254: v1(25.96,42.73) 20.22,48.47 v1(20.22,49.94)
$4N6: length 6.2
  Top Layer w0.2: 10.41,28.38 9.9,28.38
  Top Layer w0.3: 7.89,24.54 8.9,25.56 9.81,25.56 10.7,26.44 10.7,28.09 10.41,28.38
$4N11: length 9.9
  Top Layer w0.254: U9.2 16.28,29.24 17.17,28.35 17.17,22.59 L7.1
$4N1576: length 4.1
  Top Layer w0.254: R19.2 13.24,27.89 13.24,29.63 12.98,29.89 U9.4
$4N2482: length 17
  Top Layer w0.254: v1(6.76,27.08) 6.43,27.41 R18.1 ; v1(7.27,30) 9.25,30 9.53,29.72 9.53,28.4 9.5,28.38
  Top Layer w0.4: 3.37,26.78 5.27,26.78 R18.1
  Bottom Layer w0.254: v1(6.76,27.08) 7.01,27.33 7.01,29.75 v1(7.27,30) 6.38,30 2.5,33.88
$4N17108: length 16.4
  POWER w1: C31.1 58.58,36.1 54.89,39.78 52.61,39.78 50.45,41.94 C30.2
$5N5765: length 15.8
  Top Layer w0.254: D4.5 42.25,22.57 42.06,22.76 41.56,22.76 39.64,24.68 C25.2 39.99,25.11 39.99,27.89 39.53,28.35 37.75,28.35 35.72,26.32 35.46,26.32 35.16,26.01 R29.2 NSIM1.C2
$5N5772: length 13.9
  Top Layer w0.254: NSIM1.C3 35.25,23.14 R28.2 35.75,23.2 37.62,25.08 ; 37.62,25.08 37.62,26.62 C26.2 ; 37.62,25.08 37.62,24.28 38.13,23.78 39.78,23.78 41.53,22.02 D4.4
$5N5779: length 14.2
  Top Layer w0.254: v1(37.87,21.49) 37.3,22.06 R27.2 36.39,21.87 NSIM1.C7 ; D4.3 41.77,23.54 v1(41.77,24.61) 41.77,25.3
  Top Layer w0.3: v1(37.87,21.49) 38.03,21.49 39.1,22.56 R30.1
  Bottom Layer w0.254: v1(41.77,24.61) 38.66,21.49 v1(37.87,21.49)
$5N6795: length 11
  Top Layer w0.3: USB+.1 57.7,21.24 53.88,21.24 53.51,21.6 USB1.B6 53.51,24.27 52.61,25.17 52.02,25.17 51.01,26.19
$5N6807: length 8.4
  Top Layer w0.3: USB1.B7 52.71,21.13 54.13,19.71 55.68,19.71 56.52,18.88 ; 56.52,18.88 USB-.1 ; 56.52,18.88 R16.1
$5N6852: length 5
  Top Layer w0.3: USB1.A5 51.91,21.72 51.08,20.89 51.08,20.53 R15.1 50.65,20.09 CC.1
$1N3308: length 7
  Bottom Layer w0.254: 15.26,15.96 15.27,15.95 15.27,8.97
$1N9751: length 1.8
  Bottom Layer w0.254: 40.82,9.86 40.82,8.1

## Copper pours and planes (outline as drawn; the poured copper is in the pictures)
GND on GND: 30.89,60.44 50.07,59.59 60.61,49.05 60.61,18.82 57.94,16.16 1.68,16.16 -0.86,18.7 -0.86,46.64 12.86,60.35 26.95,60.35 26.95,52.2 30.89,52.2

## Text on the board
Bottom Silkscreen Layer: rev2024-06
Top Silkscreen Layer: v3.1.1 | github.com/gauteh/sfy
